# Altium schematic sheet RasPiHAT-MOSFET.SchDoc
size 409 x 282 mm; >DRAWING_NAME: RasPi-BplusHAT.sch; >LAST_DATE_TIME: 08-Jan-17 10:29:30 AM; >SHEET: 1; Sheet:: Sheet:
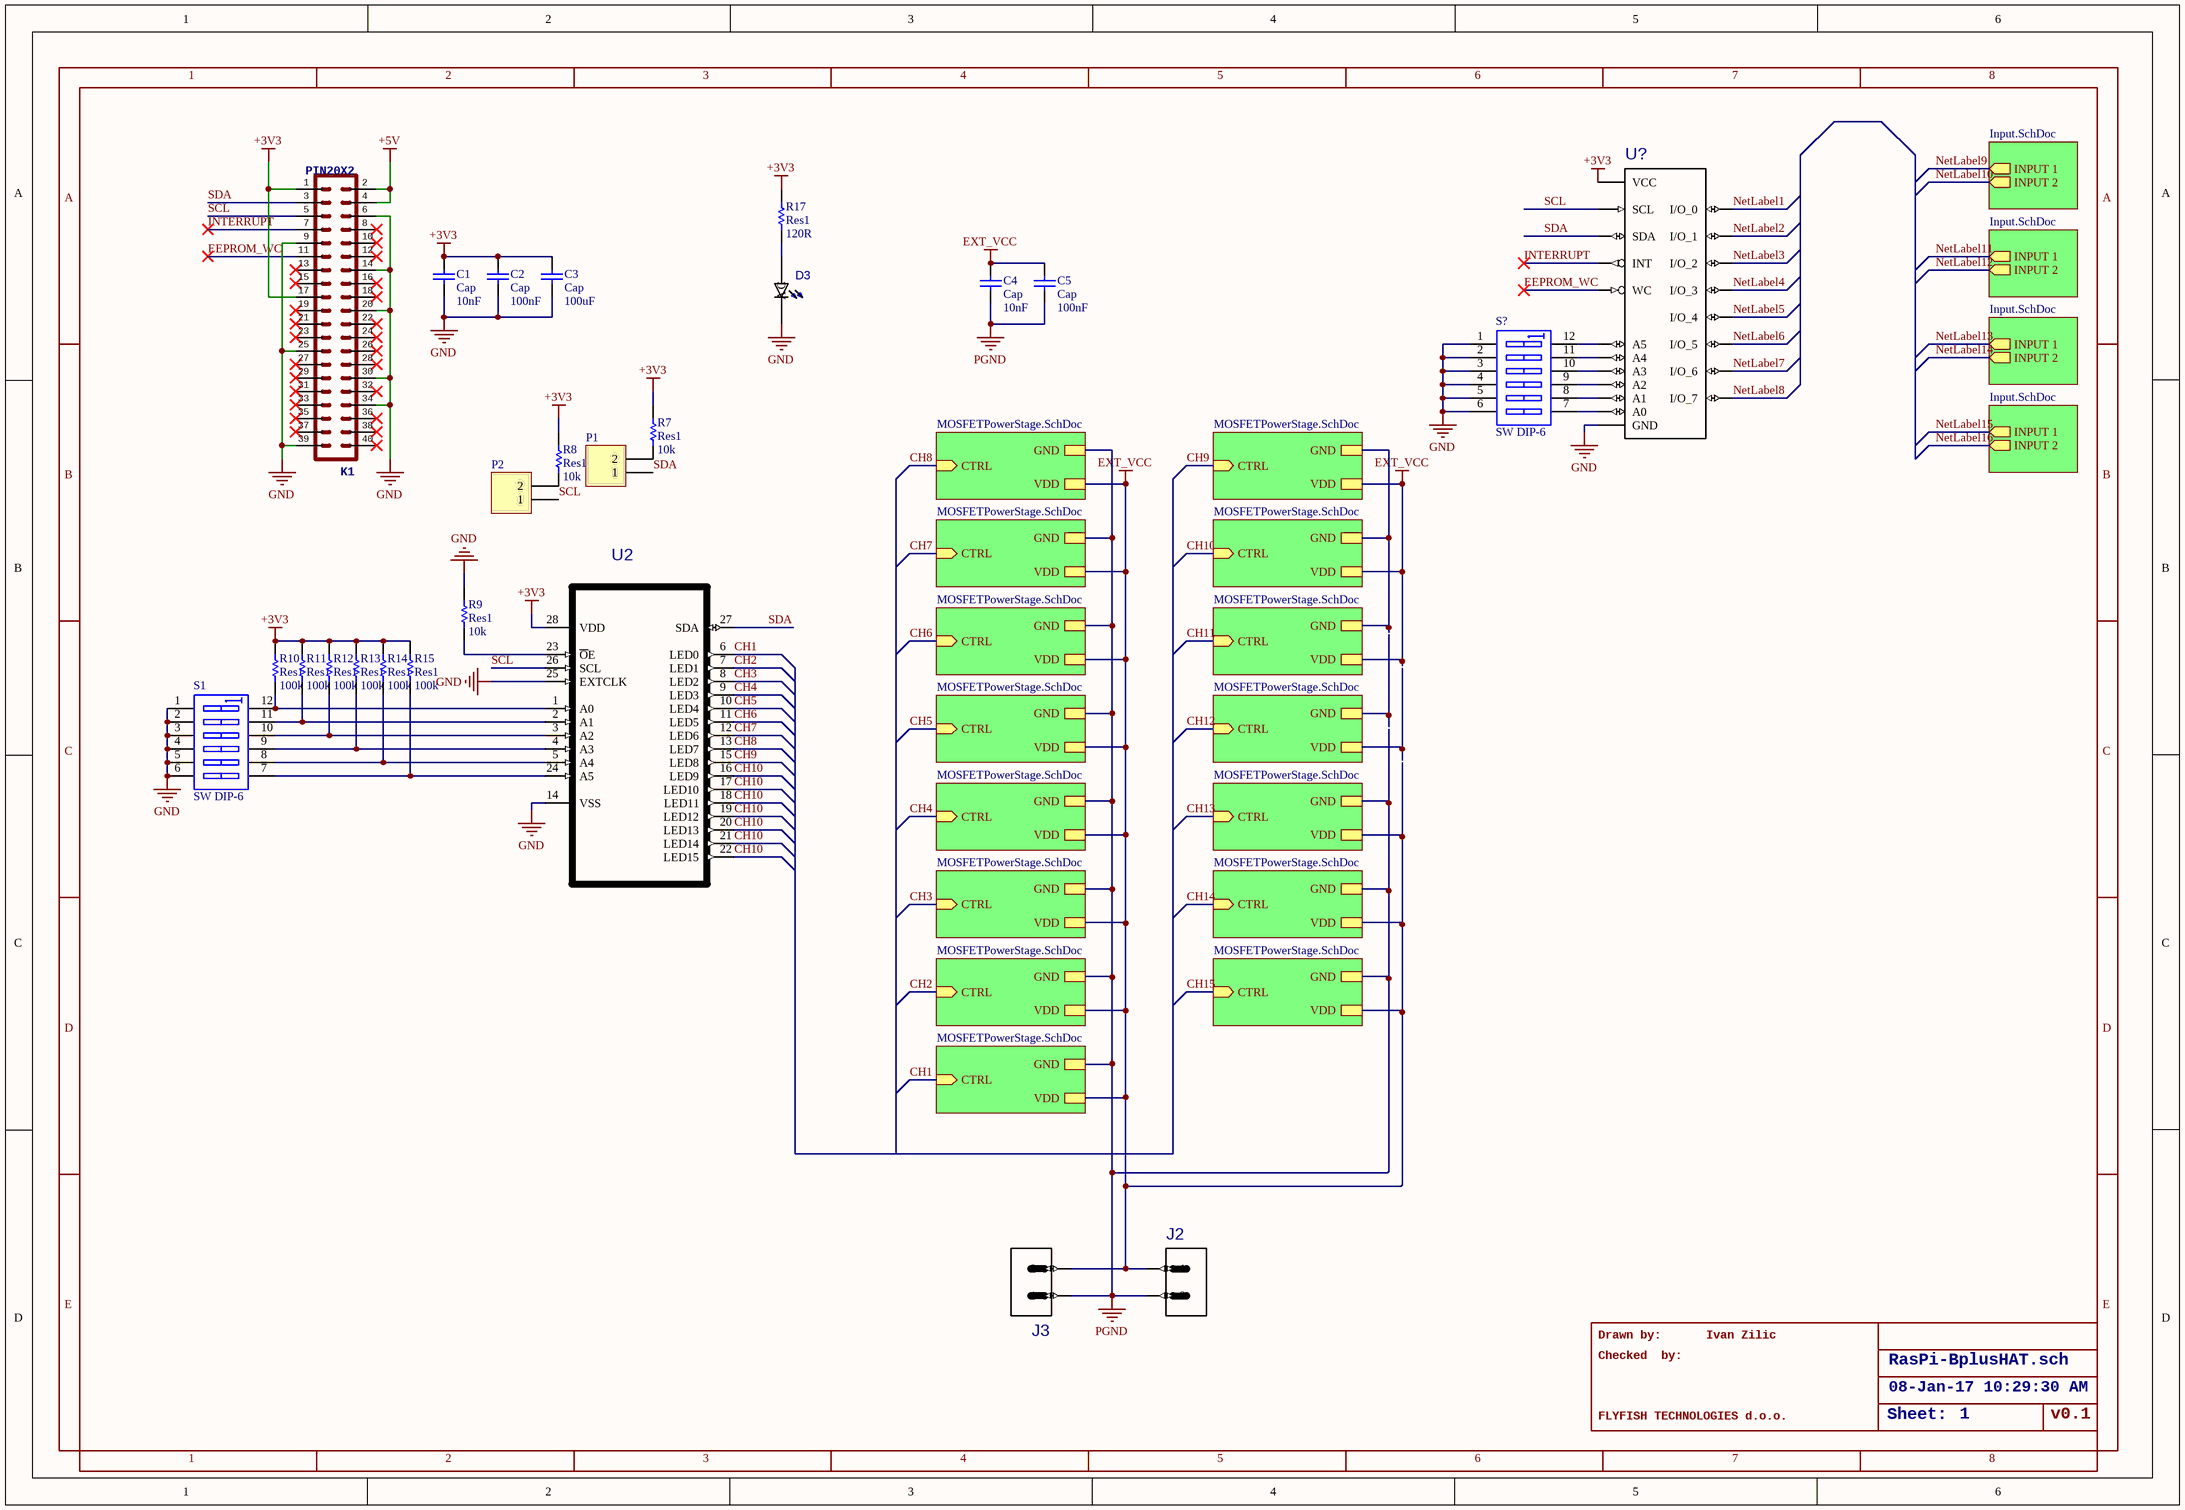
[diagram p0: RasPiHAT-MOSFET.SchDoc]

## Parts
C1  Cap  value 10nF  [6-0805_N]
C2  Cap  value 100nF  [6-0805_N]
C3  Cap  value 100uF  [6-0805_N]
C4  Cap  value 10nF  [6-0805_N]
C5  Cap  value 100nF  [6-0805_N]
D3  0805_LED  [LEDSC200X125X70-2N_598-8160-107F(Primary)]  (value not drawn)
J2  1760510000  [1760490000]  (value not drawn)
J3  1760510000  [1760490000]  (value not drawn)
K1  >NAME: K1  [HDR2X20]  (hidden comment: PIN20X2)
P1  Header 2  [HDR1X2]  (value not drawn)
P2  Header 2  [HDR1X2]  (value not drawn)
R7  Res1  value 10k  [6-0805_N]
R8  Res1  value 10k  [6-0805_N]
R9  Res1  value 10k  [6-0805_N]
R10  Res1  value 100k  [6-0805_N]
R11  Res1  value 100k  [6-0805_N]
R12  Res1  value 100k  [6-0805_N]
R13  Res1  value 100k  [6-0805_N]
R14  Res1  value 100k  [6-0805_N]
R15  Res1  value 100k  [6-0805_N]
R17  Res1  value 120R  [6-0805_N]
S1  SW DIP-6  [DIP-12/SW]
S?  SW DIP-6  [DIP-12/SW]
U2  PCA9685PW  [SOP65P640X110-28N]  (value not drawn)
U?  PCA9501  [TSSOP20]  (value not drawn)

## Sub-sheets
RM = Input.SchDoc: INPUT 1 (out), INPUT 2 (out)
RM = Input.SchDoc: INPUT 1 (out), INPUT 2 (out)
RM = Input.SchDoc: INPUT 1 (out), INPUT 2 (out)
RM = Input.SchDoc: INPUT 1 (out), INPUT 2 (out)
RM1 = MOSFETPowerStage.SchDoc: CTRL (in), VDD, GND
RM2 = MOSFETPowerStage.SchDoc: CTRL (in), VDD, GND
RM3 = MOSFETPowerStage.SchDoc: CTRL (in), VDD, GND
RM4 = MOSFETPowerStage.SchDoc: CTRL (in), VDD, GND
RM5 = MOSFETPowerStage.SchDoc: CTRL (in), VDD, GND
RM6 = MOSFETPowerStage.SchDoc: CTRL (in), VDD, GND
RM7 = MOSFETPowerStage.SchDoc: CTRL (in), VDD, GND
RM8 = MOSFETPowerStage.SchDoc: CTRL (in), VDD, GND
RM9 = MOSFETPowerStage.SchDoc: CTRL (in), VDD, GND
RM10 = MOSFETPowerStage.SchDoc: CTRL (in), VDD, GND
RM10 = MOSFETPowerStage.SchDoc: CTRL (in), VDD, GND
RM10 = MOSFETPowerStage.SchDoc: CTRL (in), VDD, GND
RM10 = MOSFETPowerStage.SchDoc: CTRL (in), VDD, GND
RM10 = MOSFETPowerStage.SchDoc: CTRL (in), VDD, GND
RM10 = MOSFETPowerStage.SchDoc: CTRL (in), VDD, GND

## Nets
+3V3: C1.2 C2.2 C3.2 K1.1 K1.17 R7.1 R8.1 R10.1 R11.1 R12.1 R13.1 R14.1 R15.1 R17.1 U2.28(VDD) U?.20(VCC)
+5V: K1.2 K1.4
EXT_VCC: C4.2 C5.2 J2.1 J3.2 ; sheet RM1/VDD, sheet RM2/VDD, sheet RM3/VDD, sheet RM4/VDD, sheet RM5/VDD, sheet RM6/VDD, sheet RM7/VDD, sheet RM8/VDD, sheet RM9/VDD, sheet RM10/VDD, sheet RM10/VDD, sheet RM10/VDD, sheet RM10/VDD, sheet RM10/VDD
GND: C1.1 C2.1 C3.1 D3.C K1.6 K1.9 K1.14 K1.20 K1.25 K1.30 K1.34 K1.39 R9.1 S1.1(A1) S1.2(A2) S1.3(A3) S1.4(A4) S1.5(A5) S1.6(A6) S?.1(A1) S?.2(A2) S?.3(A3) S?.4(A4) S?.5(A5) S?.6(A6) U2.14(VSS) U2.25(EXTCLK) U?.10(GND)
PGND: C4.1 C5.1 J2.2 J3.1 ; sheet RM1/GND, sheet RM2/GND, sheet RM3/GND, sheet RM4/GND, sheet RM5/GND, sheet RM6/GND, sheet RM7/GND, sheet RM8/GND, sheet RM10/GND, sheet RM10/GND, sheet RM10/GND
CH1: U2.6(LED0) ; sheet RM8/CTRL
CH2: U2.7(LED1) ; sheet RM7/CTRL
CH3: U2.8(LED2) ; sheet RM6/CTRL
CH4: U2.9(LED3) ; sheet RM5/CTRL
CH5: U2.10(LED4) ; sheet RM4/CTRL
CH6: U2.11(LED5) ; sheet RM3/CTRL
CH7: U2.12(LED6) ; sheet RM2/CTRL
CH8: U2.13(LED7) ; sheet RM1/CTRL
CH9: U2.15(LED8) ; sheet RM9/CTRL
CH10: U2.16(LED9) U2.17(LED10) U2.18(LED11) U2.19(LED12) U2.20(LED13) U2.21(LED14) U2.22(LED15) ; sheet RM10/CTRL
CH11: sheet RM10/CTRL
CH12: sheet RM10/CTRL
CH13: sheet RM10/CTRL
CH14: sheet RM10/CTRL
CH15: sheet RM10/CTRL
EEPROM_WC: K1.11 U?.17(WC)
INTERRUPT: K1.7 U?.8(INT)
NetLabel1: U?.4(I/O_0)
NetLabel2: U?.5(I/O_1)
NetLabel3: U?.6(I/O_2)
NetLabel4: U?.7(I/O_3)
NetLabel5: U?.13(I/O_4)
NetLabel6: U?.14(I/O_5)
NetLabel7: U?.15(I/O_6)
NetLabel8: U?.16(I/O_7)
NetLabel9: sheet RM/INPUT 1
NetLabel10: sheet RM/INPUT 2
NetLabel11: sheet RM/INPUT 1
NetLabel12: sheet RM/INPUT 2
NetLabel13: sheet RM/INPUT 1
NetLabel14: sheet RM/INPUT 2
NetLabel15: sheet RM/INPUT 1
NetLabel16: sheet RM/INPUT 2
SCL: K1.5 P2.1 U2.26(SCL) U?.18(SCL)
SDA: K1.3 P1.1 U2.27(SDA) U?.19(SDA)
NetD3_A: D3.A R17.2
NetP1_2: P1.2 R7.2
NetP2_2: P2.2 R8.2
NetR9_2: R9.2 U2.23(~{O}E)
NetR10_2: R10.2 S1.12(B1) U2.1(A0)
NetR11_2: R11.2 S1.11(B2) U2.2(A1)
NetR12_2: R12.2 S1.10(B3) U2.3(A2)
NetR13_2: R13.2 S1.9(B4) U2.4(A3)
NetR14_2: R14.2 S1.8(B5) U2.5(A4)
NetR15_2: R15.2 S1.7(B6) U2.24(A5)
NetS?_7: S?.7(B6) U?.1(A0)
NetS?_8: S?.8(B5) U?.2(A1)
NetS?_9: S?.9(B4) U?.3(A2)
NetS?_10: S?.10(B3) U?.12(A3)
NetS?_11: S?.11(B2) U?.11(A4)
NetS?_12: S?.12(B1) U?.9(A5)
(unnamed): sheet RM9/GND, sheet RM10/GND, sheet RM10/GND

Not connected (* = marked no-connect by the designer): K1 8* 10* 12* 13* 15* 16* 18* 19* 21* 22* 23* 24* 26* 27* 28* 29* 31* 32* 33* 35* 36* 37* 38* 40*

## Notes on the sheet
- Drawn by:
- Checked  by:
- Ivan Zilic
- FLYFISH TECHNOLOGIES d.o.o.
- v0.1
- 1
- 2
- 3
- 4
- 5
- 6
- 7
- 8
- A
- B
- C
- D
- E

## Library data of the parts
C1-C5 = Cap: Capacitor; Published: 8-Jun-2000; LatestRevisionDate: 17-Jul-2002; LatestRevisionNote: Re-released for DXP Platform.; PackageReference: RAD-0.3; Publisher: Altium Limited; PackageDescription: Radial Cap, Thru-Hole; 2 Leads; 0.3 in Pin Spacing
D3 = 598-8160-107F: LED, SMD; 0805; Yellow-Green; Water Clear Lens; 40mcd; 570/575nm; MF: Dialight; Package: 0805 Dialight; MP: 598-8160-107F; Price: 0.09 USD; Availability: Good; Value: *
J2 J3 = 1760510000: Conn Terminal Block 2 POS 5.08mm Solder ST Thru-Hole 16A; MF: Weidmuller; Package: None; MP: 1760510000; Price: 0.43 USD; Availability: Good; Value: *
P1 P2 = Header 2: Header, 2-Pin; LatestRevisionDate: 17-Jul-2002; LatestRevisionNote: Re-released for DXP Platform.; Publisher: Altium Limited
R7-R15 R17 = Res1: Resistor; Published: 8-Jun-2000; LatestRevisionDate: 17-Jul-2002; LatestRevisionNote: Re-released for DXP Platform.; PackageReference: AXIAL-0.3; Publisher: Altium Limited; PackageDescription: Axial Device, Thru-Hole; 2 Leads; 0.3 in Pin Spacing
S1 S? = SW DIP-6: DIP Switch, 6 Position, SPST; Published: 24-Mar-1999; LatestRevisionDate: 17-Jul-2002; LatestRevisionNote: Re-released for DXP Platform.; PackageReference: DIP-12/SW; Publisher: Altium Limited; PackageDescription: DIP Switch; 12 Leads
U2 = PCA9685PW: SMD IC LED DRVR, LIN DIM 25MA, 16 channels, 12bit; MF: NXP Semiconductors; Price: 1.71 USD; Package: TSSOP-28 NXP Semiconductors; MP: PCA9685PW; Availability: Warning; Value: *
U? = PCA9501: MF: NXP Semiconductors; MP: PCA9501; Package: None; Availability: Unavailable; Price: None; Value: *
K1 = PIN20X2: >VALUE: PIN20X2